# Altium schematic sheet Step_Gen.SchDoc
size A4; ApprovedBy: Mateusz Kowalik; CheckedBy: Mateusz Kowalik; Author: Mateusz Kowalik; CompanyName: InMotion Labs sp. z o.o.; DrawnBy: Mateusz Kowalik; Engineer: Mateusz Kowalik; Organization: InMotion Labs sp. z o.o.; Address1: Rydlówka 5A; Address2: 30-363 Kraków; Address4: Poland; DocumentNumber: 9; Revision: Rev 0; SheetNumber: 8; SheetTotal: 17
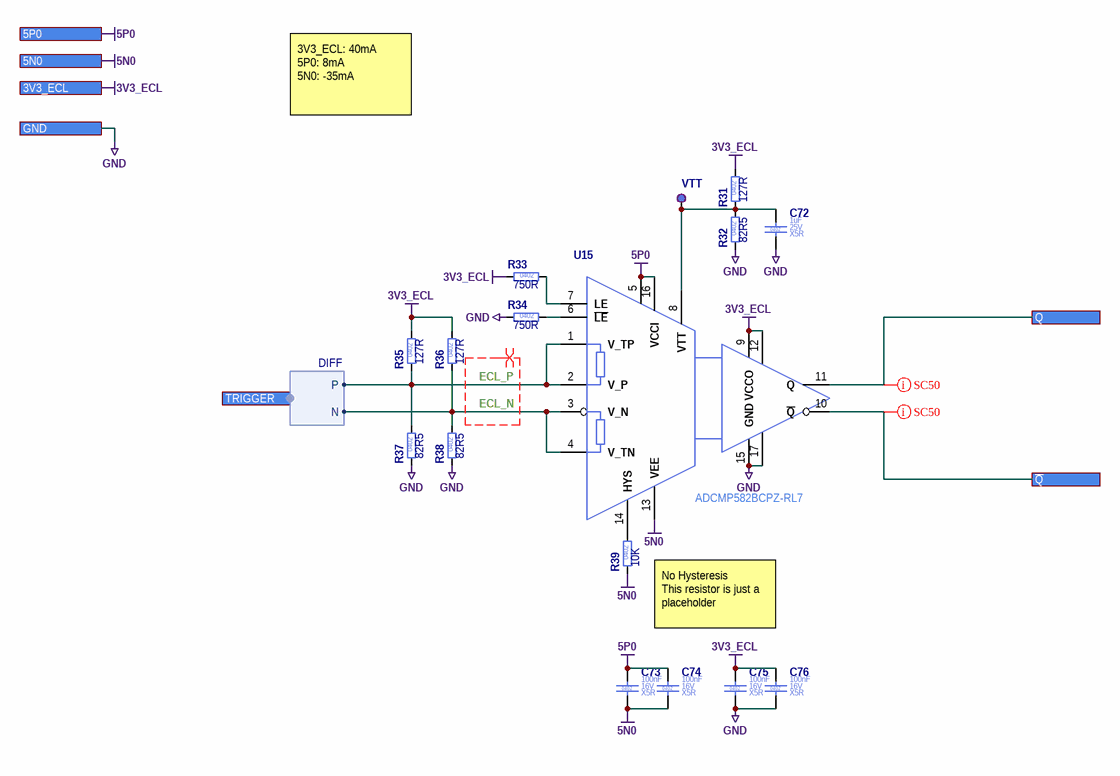
[diagram p0: Step_Gen.SchDoc]

## Parts
C72  Case/Package: 0402  Voltage Rating (DC): 25V  Dielectric: X5R  Capacitance: 1uF  [C_0402_1005]  (hidden comment: C_1UF_25V_X5R_0402_10)
C73  Case/Package: 0402  Voltage Rating (DC): 16V  Dielectric: X5R  Capacitance: 100nF  [C_0402_1005]  (hidden comment: C_100NF_16V_X5R_0402_10)
C74  Case/Package: 0402  Voltage Rating (DC): 16V  Dielectric: X5R  Capacitance: 100nF  [C_0402_1005]  (hidden comment: C_100NF_16V_X5R_0402_10)
C75  Case/Package: 0402  Voltage Rating (DC): 16V  Dielectric: X5R  Capacitance: 100nF  [C_0402_1005]  (hidden comment: C_100NF_16V_X5R_0402_10)
C76  Case/Package: 0402  Voltage Rating (DC): 16V  Dielectric: X5R  Capacitance: 100nF  [C_0402_1005]  (hidden comment: C_100NF_16V_X5R_0402_10)
R31  Resistance: 127R  Case/Package: 0402  [R_0402_1005]  (hidden comment: R_127R_0402_1)
R32  Resistance: 82R5  Case/Package: 0402  [R_0402_1005]  (hidden comment: R_82R5_0402_1)
R33  Resistance: 750R  Case/Package: 0402  [R_0402_1005]  (hidden comment: R_750R_0402_1)
R34  Resistance: 750R  Case/Package: 0402  [R_0402_1005]  (hidden comment: R_750R_0402_1)
R35  Resistance: 127R  Case/Package: 0402  [R_0402_1005]  (hidden comment: R_127R_0402_1)
R36  Resistance: 127R  Case/Package: 0402  [R_0402_1005]  (hidden comment: R_127R_0402_1)
R37  Resistance: 82R5  Case/Package: 0402  [R_0402_1005]  (hidden comment: R_82R5_0402_1)
R38  Resistance: 82R5  Case/Package: 0402  [R_0402_1005]  (hidden comment: R_82R5_0402_1)
R39  Resistance: 10K  Case/Package: 0402  [R_0402_1005]  (hidden comment: R_10K_0402_1)
U15  ADCMP582BCPZ-RL7  [QFN50P300X300X100_HS-17N]
VTT  TP_PAD_1.3MM  [TP_PAD_1.3MM]  (value not drawn)  (no BOM)

## Ports
3V3_ECL, 5N0, 5P0, GND, Q, TRIGGER (harness DIFF), ~{Q}

## Harnesses
DIFF: P, N

## Nets
3V3_ECL: C75.1 C76.1 R31.2 R33.1 R35.2 R36.2 U15.9(VCCO) U15.12(VCCO) ; port 3V3_ECL
5N0: C73.2 C74.2 R39.1 U15.13(VEE) ; port 5N0
5P0: C73.1 C74.1 U15.5(VCCI) U15.16(VCCI) ; port 5P0
GND: C72.2 C75.2 C76.2 R32.1 R34.1 R37.1 R38.1 U15.15(GND) U15.17(GND) ; port GND
~{Q}: U15.10(~{Q}) ; port ~{Q}
ECL_N: R36.1 R38.2 U15.3(V_N) U15.4(V_TN) ; port TRIGGER.N
ECL_P: R35.1 R37.2 U15.1(V_TP) U15.2(V_P) ; port TRIGGER.P
Q: U15.11(Q) ; port Q
NetC72_1: C72.1 R31.1 R32.2 U15.8(VTT) VTT.1(TP)
NetR33_2: R33.2 U15.7(LE)
NetR34_2: R34.2 U15.6(~{LE})
NetR39_2: R39.2 U15.14(HYS)

## Layout directives
net class SC50: Q, ~{Q}
differential pair; differential pair class D100; net class D100: ECL_N, ECL_P

## Notes on the sheet
- 3V3_ECL: 40mA
  5P0: 8mA
  5N0: -35mA
- (near R39) No Hysteresis
  This resistor is just a placeholder
- Title
- Size:
- Date:
- A4

## Library data of the parts
C72 = C_1UF_25V_X5R_0402_10: Ceramic Capacitor; Manufacturer Part Number: CL05A105KA5NQNC; Manufacturer: Samsung Electro-Mechanics; Value: 1uF; Tolerance: 10%; Part Number: C_1UF_25V_X5R_0402_10; Mount: Surface Mount; Height: 550um; HelpURL: https://pl.mouser.com/datasheet/2/585/MLCC-1837944.pdf; RoHS: Compliant; Max Operating Temperature: 85°C; Status: MK; Supplier 1: Mouser; Supplier Part Number 1: 187-CL05A105KA5NQNC; Manufacturer 2: Samsung Electro-Mechanics; Manufacturer Part Number 2: CL05A105KA5NQNC; Supplier 2: LCSC; Supplier Part Number 2: C52923
C73-C76 = C_100NF_16V_X5R_0402_10: Ceramic Capacitor; Manufacturer Part Number: EMK105BJ104KV-F; Manufacturer: Taiyo Yuden; Value: 100nF; Tolerance: 10%; Part Number: C_100NF_16V_X5R_0402_10; Mount: Surface Mount; Height: 500um; HelpURL: http://datasheet.octopart.com/EMK105BJ104KV-F-Taiyo-Yuden-datasheet-8857305.pdf; RoHS: Compliant; Max Operating Temperature: 125°C; Status: MK; Supplier 1: Mouser; Supplier Part Number 1: 963-EMK105BJ104KV-F; Manufacturer 2: Samsung Electro-Mechanics; Manufacturer Part Number 2: CL05B104KO5NNNC; Supplier 2: LCSC; Supplier Part Number 2: C1525
R31 R35 R36 = R_127R_0402_1: Thick Film Resistor; Manufacturer: Yageo; Manufacturer Part Number: RC0402FR-07127RL; Value: 127R; Tolerance: 1%; Voltage Rating (DC): 50V; Power Rating: 63mW; Stats: MK; Part Number: R_127R_0402_1; Mount: Surface Mount; Height: 350um; HelpURL: https://pl.mouser.com/datasheet/2/447/PYu_RC_Group_51_RoHS_L_10-1664068.pdf; RoHS: Compliant; Max Operating Temperature: 155°C; Supplier 1: Mouser; Supplier Part Number 1: 603-RC0402FR-07127RL; Manufacturer 2: Uniroyal Elec; Manufacturer Part Number 2: 0402WGF1270TCE; Supplier 2: LCSC; Supplier Part Number 2: C247127
R32 R37 R38 = R_82R5_0402_1: Thick Film Resistor; Manufacturer: Yageo; Manufacturer Part Number: RC0402FR-0782R5L; Value: 82R5; Tolerance: 1%; Voltage Rating (DC): 50V; Power Rating: 63mW; Stats: MK; Part Number: R_82R5_0402_1; Mount: Surface Mount; Height: 350um; HelpURL: https://pl.mouser.com/datasheet/2/447/PYu-RC_Group_51_RoHS_L_10-1527934.pdf; RoHS: Compliant; Max Operating Temperature: 155°C; Supplier 1: Mouser; Supplier Part Number 1: 603-RC0402FR-0782R5L; Manufacturer 2: Uniroyal Elec; Manufacturer Part Number 2: 0402WGF825JTCE; Supplier 2: LCSC; Supplier Part Number 2: C52037
R33 R34 = R_750R_0402_1: Thick Film Resistor; Manufacturer: Yageo; Manufacturer Part Number: RC0402FR-07750RL; Value: 750R; Tolerance: 1%; Voltage Rating (DC): 50V; Power Rating: 63mW; Stats: MK; Part Number: R_750R_0402_1; Mount: Surface Mount; Height: 350um; HelpURL: https://pl.mouser.com/datasheet/2/447/PYu-RC_Group_51_RoHS_L_10-1664068.pdf; RoHS: Compliant; Max Operating Temperature: 155°C; Supplier 1: Mouser; Supplier Part Number 1: 603-RC0402FR-07750RL; Manufacturer 2: Uniroyal Elec; Manufacturer Part Number 2: 0402WGF7500TCE; Supplier 2: LCSC; Supplier Part Number 2: C25132
R39 = R_10K_0402_1: Thick Film Resistor; Manufacturer: Yageo; Manufacturer Part Number: RC0402FR-7W10KL; Value: 10K; Tolerance: 1%; Voltage Rating (DC): 50V; Power Rating: 63mW; Stats: MK; Part Number: R_10K_0402_1; Mount: Surface Mount; Height: 350um; HelpURL: https://pl.mouser.com/datasheet/2/447/PYu-RC_Group_51_RoHS_L_10-1664068.pdf; RoHS: Compliant; Max Operating Temperature: 155°C; Supplier 1: Mouser; Supplier Part Number 1: 603-RC0402FR-7W10KL; Manufacturer 2: Uniroyal Elec; Manufacturer Part Number 2: 0402WGF1002TCE; Supplier 2: LCSC; Supplier Part Number 2: C25744
U15 = ADCMP582BCPZ-RL7: Single Comparator; Manufacturer: Analog Devices; Number of Comparators: 1; Response Time: 180ps; Input Offset Voltage: 4mV; Marking: G10; Max Supply Voltage: 5.5V; Min Supply Voltage: 4.5V; Part Number: ADCMP582BCPZ-RL7; Manufacturer Part Number: ADCMP582BCPZ-RL7; Case/Package: QFN14; Mount: Surface Mount; Height: 0.8mm; Max Operating Temperature: 125; HelpURL: https://www.analog.com/media/en/technical-documentation/data-sheets/ADCMP580_581_582.pdf; Number of Pins: 16; RoHS: Compliant
VTT = TP_PAD_1.3MM: Testpoint SMD 1.3mm; Part Number: TP_PAD_1.3MM; Case/Package: SMD; Length: 0mm